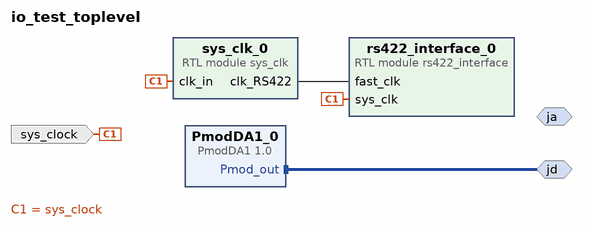
[diagram p0: block diagram of the top level]
# Vivado block design io_test_toplevel, xc7a100tcsg324-1, Vivado 2022.2
create_bd_design io_test_toplevel

create_bd_intf_port -mode Master -vlnv digilentinc.com:interface:pmod_rtl:1.0 jd
create_bd_intf_port -mode Master -vlnv digilentinc.com:interface:pmod_rtl:1.0 ja
create_bd_port -dir I -type clk sys_clock
set_property -dict {CONFIG.FREQ_HZ 100000000 CONFIG.PHASE 0.0} [get_bd_ports sys_clock]

create_bd_cell -type ip -vlnv digilentinc.com:IP:PmodDA1:1.0 PmodDA1_0
set_property -dict {CONFIG.PMOD jd CONFIG.USE_BOARD_FLOW true} [get_bd_cells PmodDA1_0]
create_bd_cell -type module -reference rs422_interface rs422_interface_0
create_bd_cell -type module -reference sys_clk sys_clk_0

# ---- connections ----

connect_bd_intf_net [get_bd_intf_ports jd] [get_bd_intf_pins PmodDA1_0/Pmod_out]
connect_bd_net [get_bd_pins sys_clk_0/clk_RS422] [get_bd_pins rs422_interface_0/fast_clk]
connect_bd_net [get_bd_ports sys_clock] [get_bd_pins sys_clk_0/clk_in] [get_bd_pins rs422_interface_0/sys_clk]

validate_bd_design
save_bd_design
